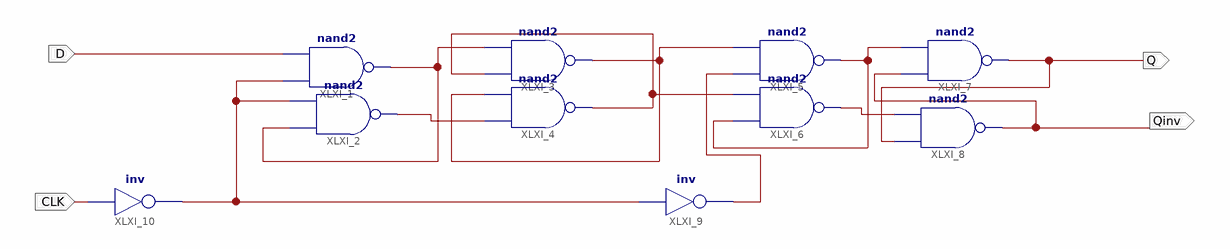
[diagram p0: schematic sheet 1]
// Xilinx ISE schematic D_ff.sch (artix7) as structural Verilog: 10 symbols, 4 ports
module D_ff (
  input  D,
  input  CLK,
  output Qinv,
  output Q
);

  wire XLXN_3, XLXN_4, XLXN_6, XLXN_7, XLXN_10, XLXN_11, XLXN_12, XLXN_14;

  nand XLXI_1 (XLXN_4, XLXN_3, D);
  nand XLXI_2 (XLXN_6, XLXN_4, XLXN_3);
  nand XLXI_3 (XLXN_7, XLXN_10, XLXN_4);
  nand XLXI_4 (XLXN_10, XLXN_6, XLXN_7);
  nand XLXI_5 (XLXN_12, XLXN_11, XLXN_7);
  nand XLXI_6 (XLXN_14, XLXN_12, XLXN_10);
  nand XLXI_7 (Q, Qinv, XLXN_12);
  nand XLXI_8 (Qinv, Q, XLXN_14);
  not XLXI_9 (XLXN_11, XLXN_3);
  not XLXI_10 (XLXN_3, CLK);
endmodule
